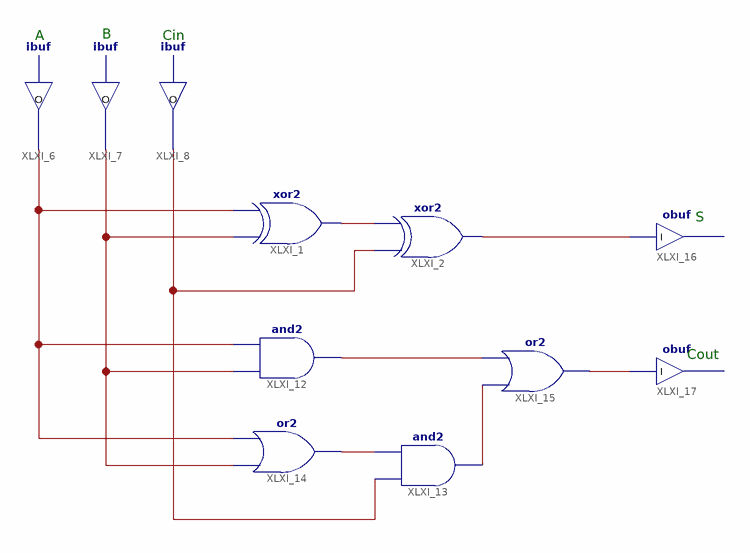
[diagram p0: schematic sheet 1]
// Xilinx ISE schematic Full_Adder_Schematic.sch (spartan3e) as structural Verilog: 11 symbols, 0 ports
module Full_Adder_Schematic (
);

  wire XLXN_1, XLXN_2, XLXN_5, XLXN_6, XLXN_7, XLXN_9, XLXN_13, XLXN_14, XLXN_15;

  xor XLXI_1 (XLXN_5, XLXN_2, XLXN_1);
  xor XLXI_2 (XLXN_14, XLXN_6, XLXN_5);
  ibuf XLXI_6 (.O(XLXN_1));  // open: I
  ibuf XLXI_7 (.O(XLXN_2));  // open: I
  ibuf XLXI_8 (.O(XLXN_6));  // open: I
  and XLXI_12 (XLXN_9, XLXN_2, XLXN_1);
  and XLXI_13 (XLXN_13, XLXN_6, XLXN_7);
  or XLXI_14 (XLXN_7, XLXN_2, XLXN_1);
  or XLXI_15 (XLXN_15, XLXN_13, XLXN_9);
  obuf XLXI_16 (.I(XLXN_14));  // open: O
  obuf XLXI_17 (.I(XLXN_15));  // open: O

  // Notes on the sheet:
  //   B
  //   A
  //   Cin
  //   S
  //   Cout
endmodule
